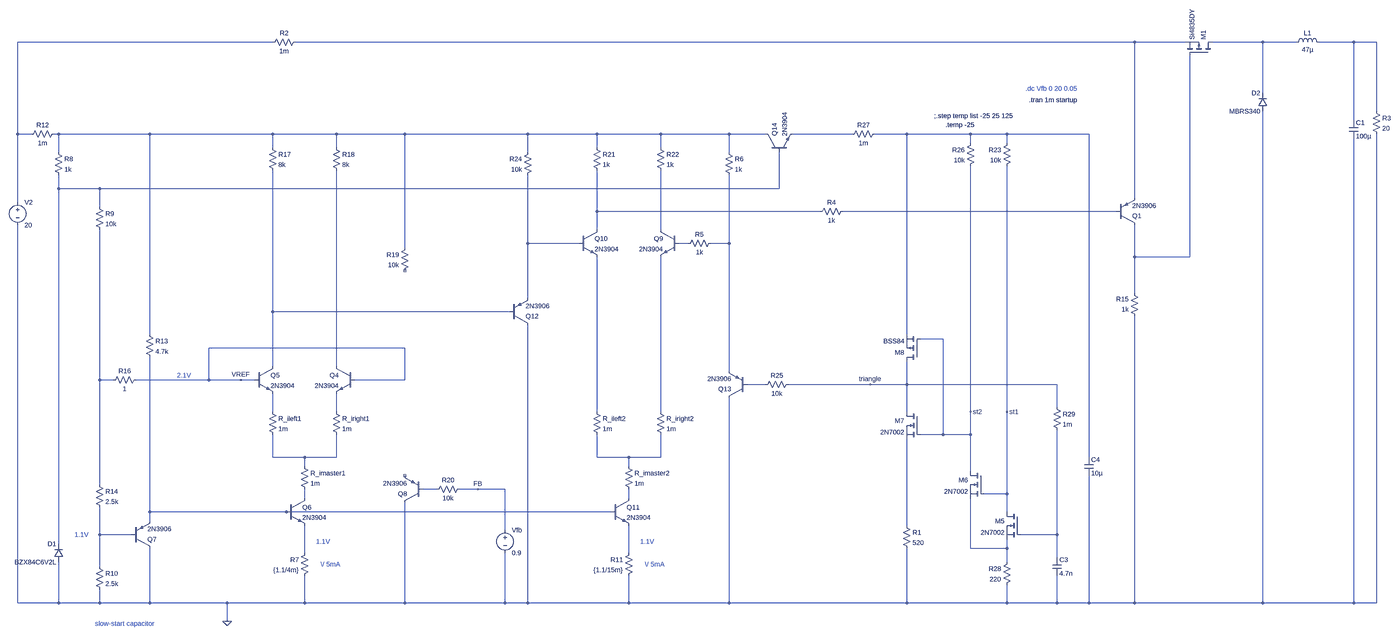
[diagram p0: schematic step_down_trial2_1.asc, whole sheet]
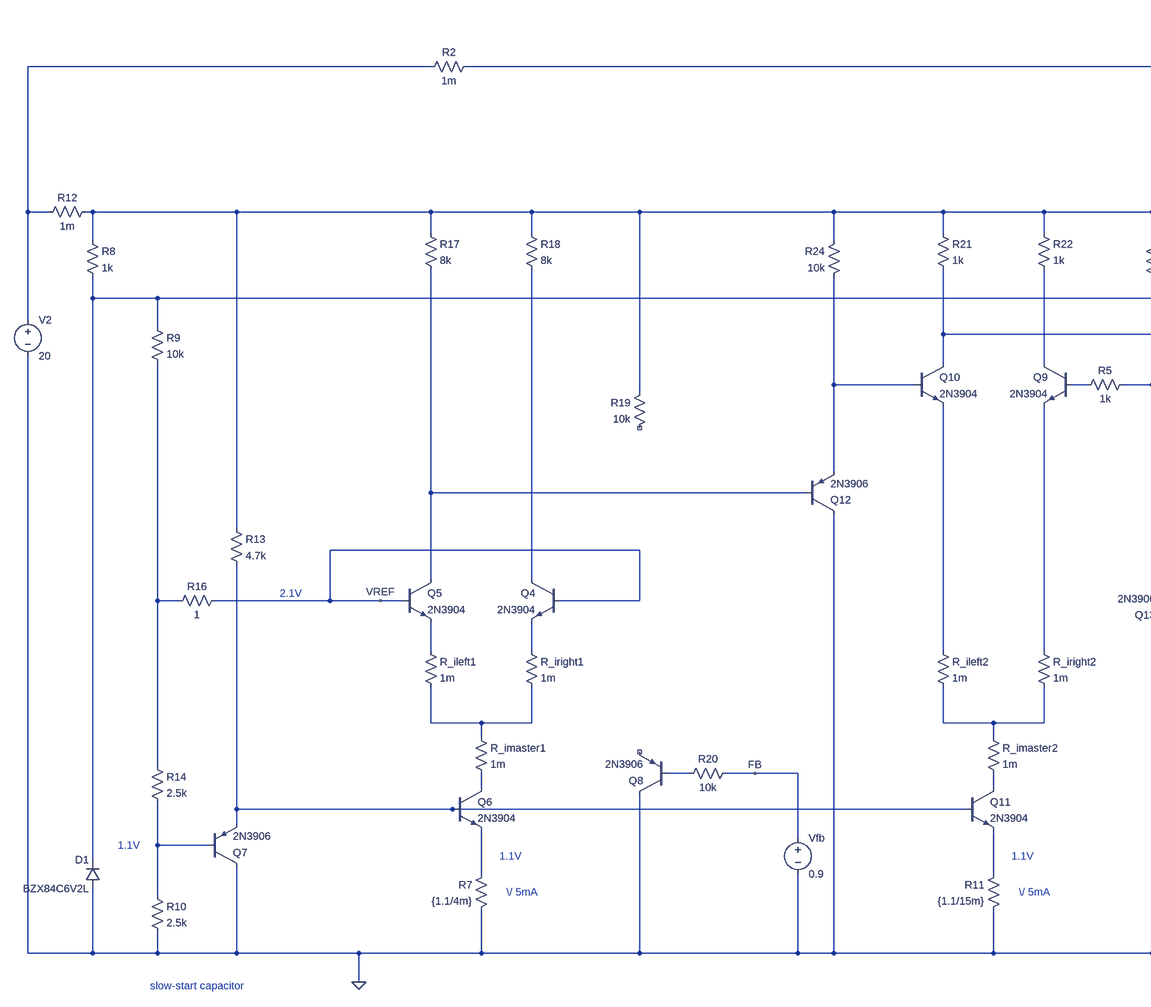
[diagram p1: schematic step_down_trial2_1.asc, part, row 1 of 1, column 1 of 2]
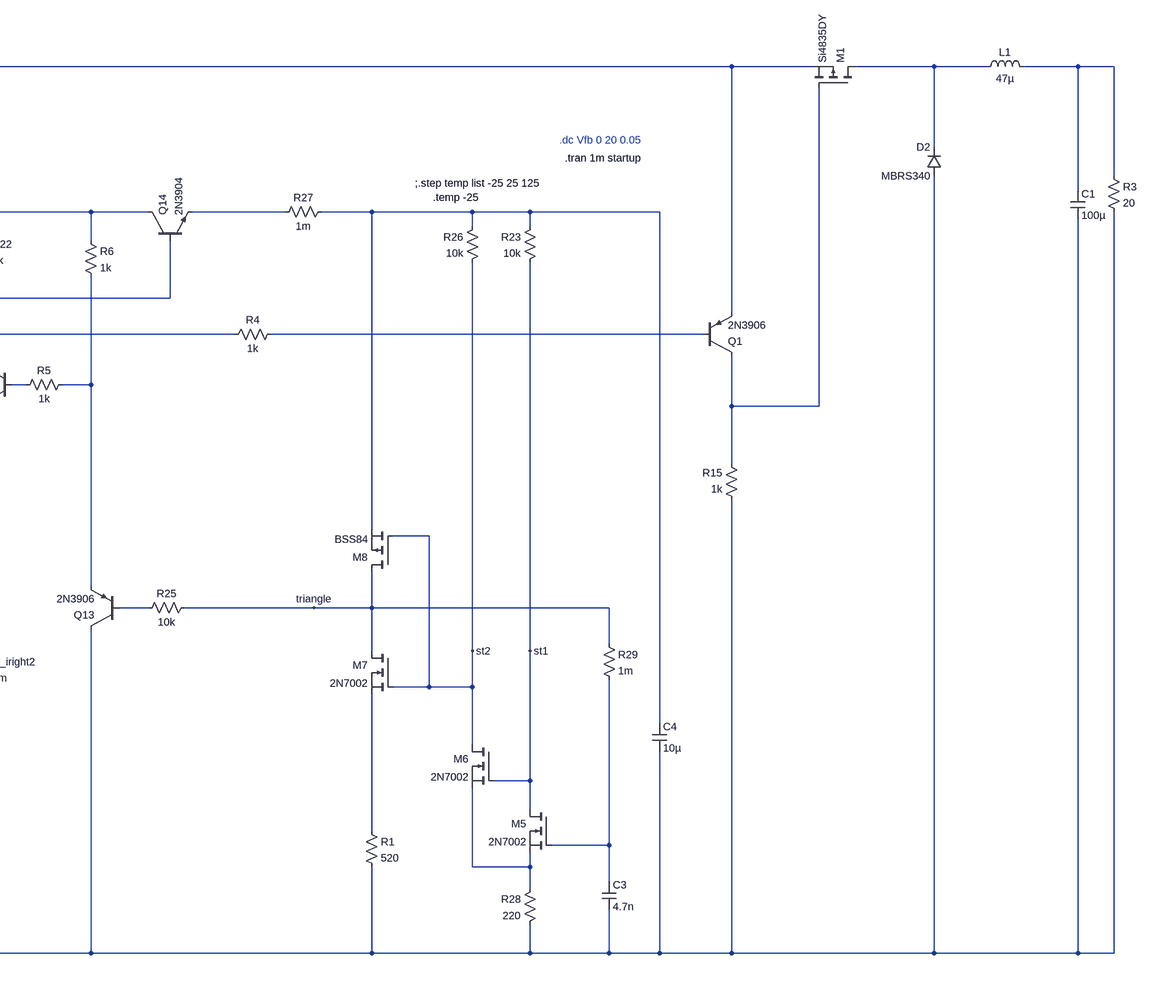
[diagram p2: schematic step_down_trial2_1.asc, part, row 1 of 1, column 2 of 2]
step_down_trial2_1.asc, the LTspice schematic file:
Version 4.1
SHEET 1 6680 712
WIRE 2512 -1392 1616 -1392
WIRE 5584 -1392 2592 -1392
WIRE 5824 -1392 5584 -1392
WIRE 6096 -1392 5920 -1392
WIRE 6224 -1392 6096 -1392
WIRE 6544 -1392 6304 -1392
WIRE 6624 -1392 6544 -1392
WIRE 6096 -1168 6096 -1392
WIRE 6624 -1104 6624 -1392
WIRE 6544 -1072 6544 -1392
WIRE 1616 -1024 1616 -1392
WIRE 1664 -1024 1616 -1024
WIRE 1760 -1024 1744 -1024
WIRE 2080 -1024 1760 -1024
WIRE 2512 -1024 2080 -1024
WIRE 2736 -1024 2512 -1024
WIRE 2976 -1024 2736 -1024
WIRE 3408 -1024 2976 -1024
WIRE 3696 -1024 3408 -1024
WIRE 3920 -1024 3696 -1024
WIRE 4160 -1024 3920 -1024
WIRE 4288 -1024 4160 -1024
WIRE 4592 -1024 4384 -1024
WIRE 4784 -1024 4672 -1024
WIRE 5008 -1024 4784 -1024
WIRE 5136 -1024 5008 -1024
WIRE 5424 -1024 5136 -1024
WIRE 5008 -992 5008 -1024
WIRE 5136 -992 5136 -1024
WIRE 2512 -976 2512 -1024
WIRE 2736 -976 2736 -1024
WIRE 3696 -976 3696 -1024
WIRE 3920 -976 3920 -1024
WIRE 1760 -960 1760 -1024
WIRE 3408 -960 3408 -1024
WIRE 4160 -960 4160 -1024
WIRE 1760 -832 1760 -880
WIRE 1904 -832 1760 -832
WIRE 4336 -832 4336 -960
WIRE 4336 -832 1904 -832
WIRE 5584 -800 5584 -1392
WIRE 1616 -784 1616 -1024
WIRE 1904 -768 1904 -832
WIRE 3696 -752 3696 -896
WIRE 4480 -752 3696 -752
WIRE 5520 -752 4560 -752
WIRE 3696 -688 3696 -752
WIRE 3920 -688 3920 -896
WIRE 3408 -640 3408 -880
WIRE 3632 -640 3408 -640
WIRE 4016 -640 3984 -640
WIRE 4160 -640 4160 -880
WIRE 4160 -640 4096 -640
WIRE 2976 -624 2976 -1024
WIRE 5584 -592 5584 -704
WIRE 5840 -592 5840 -1344
WIRE 5840 -592 5584 -592
WIRE 5584 -464 5584 -592
WIRE 3408 -448 3408 -640
WIRE 2512 -400 2512 -896
WIRE 3344 -400 2512 -400
WIRE 2080 -320 2080 -1024
WIRE 4784 -320 4784 -1024
WIRE 4912 -304 4832 -304
WIRE 2976 -272 2288 -272
WIRE 2512 -208 2512 -400
WIRE 2736 -208 2736 -896
WIRE 4160 -192 4160 -640
WIRE 1904 -160 1904 -688
WIRE 1952 -160 1904 -160
WIRE 2288 -160 2288 -272
WIRE 2288 -160 2032 -160
WIRE 2400 -160 2288 -160
WIRE 2448 -160 2400 -160
WIRE 2976 -160 2976 -272
WIRE 2976 -160 2800 -160
WIRE 4288 -144 4224 -144
WIRE 4656 -144 4368 -144
WIRE 4784 -144 4784 -224
WIRE 4784 -144 4656 -144
WIRE 5312 -144 4784 -144
WIRE 5312 -64 5312 -144
WIRE 2512 -48 2512 -112
WIRE 2736 -48 2736 -112
WIRE 3696 -48 3696 -592
WIRE 3920 -48 3920 -592
WIRE 4784 -48 4784 -144
WIRE 5008 -48 5008 -912
WIRE 5136 -48 5136 -912
WIRE 4912 32 4912 -304
WIRE 4912 32 4832 32
WIRE 5008 32 5008 -48
WIRE 5008 32 4912 32
WIRE 2512 112 2512 32
WIRE 2624 112 2512 112
WIRE 2736 112 2736 32
WIRE 2736 112 2624 112
WIRE 3696 112 3696 32
WIRE 3808 112 3696 112
WIRE 3920 112 3920 32
WIRE 3920 112 3808 112
WIRE 5424 112 5424 -1024
WIRE 2624 144 2624 112
WIRE 3808 144 3808 112
WIRE 5008 160 5008 32
WIRE 1904 208 1904 -160
WIRE 3088 224 3040 224
WIRE 3232 224 3168 224
WIRE 3328 224 3232 224
WIRE 5136 240 5136 -48
WIRE 5136 240 5056 240
WIRE 2624 256 2624 224
WIRE 3808 256 3808 224
WIRE 2080 304 2080 -240
WIRE 2560 304 2080 304
WIRE 3744 304 2560 304
WIRE 5136 304 5136 240
WIRE 2080 336 2080 304
WIRE 4784 352 4784 48
WIRE 3328 368 3328 224
WIRE 1904 384 1904 288
WIRE 2016 384 1904 384
WIRE 5312 384 5312 16
WIRE 5312 384 5184 384
WIRE 1760 416 1760 -832
WIRE 5008 432 5008 256
WIRE 5136 432 5136 400
WIRE 5136 432 5008 432
WIRE 2624 448 2624 352
WIRE 3808 448 3808 352
WIRE 5312 464 5312 384
WIRE 5136 480 5136 432
WIRE 1904 496 1904 384
WIRE 1616 624 1616 -704
WIRE 1760 624 1760 480
WIRE 1760 624 1616 624
WIRE 1904 624 1904 576
WIRE 1904 624 1760 624
WIRE 2080 624 2080 432
WIRE 2080 624 1904 624
WIRE 2352 624 2080 624
WIRE 2624 624 2624 528
WIRE 2624 624 2352 624
WIRE 2976 624 2976 272
WIRE 2976 624 2624 624
WIRE 3328 624 3328 448
WIRE 3328 624 2976 624
WIRE 3408 624 3408 -352
WIRE 3408 624 3328 624
WIRE 3808 624 3808 528
WIRE 3808 624 3408 624
WIRE 4160 624 4160 -96
WIRE 4160 624 3808 624
WIRE 4784 624 4784 432
WIRE 4784 624 4160 624
WIRE 5136 624 5136 560
WIRE 5136 624 4784 624
WIRE 5312 624 5312 528
WIRE 5312 624 5136 624
WIRE 5424 624 5424 176
WIRE 5424 624 5312 624
WIRE 5584 624 5584 -384
WIRE 5584 624 5424 624
WIRE 6096 624 6096 -1104
WIRE 6096 624 5584 624
WIRE 6544 624 6544 -1008
WIRE 6544 624 6096 624
WIRE 6624 624 6624 -1024
WIRE 6624 624 6544 624
WIRE 2352 688 2352 624
FLAG 4656 -144 triangle
FLAG 2352 688 0
FLAG 2400 -160 VREF
FLAG 3232 224 FB
FLAG 5136 -48 st1
FLAG 5008 -48 st2
SYMBOL voltage 1616 -800 R0
SYMATTR InstName V2
SYMATTR Value 20
SYMBOL res 2640 432 M0
SYMATTR InstName R7
SYMATTR Value {1.1/4m}
SYMBOL npn 2800 -208 M0
SYMATTR InstName Q4
SYMATTR Value 2N3904
SYMBOL npn 2448 -208 R0
SYMATTR InstName Q5
SYMATTR Value 2N3904
SYMBOL diode 1776 480 R180
WINDOW 0 24 64 Left 2
WINDOW 3 24 0 Left 2
SYMATTR InstName D1
SYMATTR Value BZX84C6V2L
SYMBOL res 1744 -976 R0
SYMATTR InstName R8
SYMATTR Value 1k
SYMBOL res 1888 -784 R0
SYMATTR InstName R9
SYMATTR Value 10k
SYMBOL res 1888 480 R0
SYMATTR InstName R10
SYMATTR Value 2.5k
SYMBOL res 1648 -1008 R270
WINDOW 0 32 56 VTop 2
WINDOW 3 0 56 VBottom 2
SYMATTR InstName R12
SYMATTR Value 1m
SYMBOL res 2608 128 R0
SYMATTR InstName R_imaster1
SYMATTR Value 1m
SYMBOL npn 2560 256 R0
SYMATTR InstName Q6
SYMATTR Value 2N3904
SYMBOL res 2064 -336 R0
SYMATTR InstName R13
SYMATTR Value 4.7k
SYMBOL pnp 2016 432 M180
SYMATTR InstName Q7
SYMATTR Value 2N3906
SYMBOL res 1888 192 R0
SYMATTR InstName R14
SYMATTR Value 2.5k
SYMBOL res 2496 -64 R0
SYMATTR InstName R_ileft1
SYMATTR Value 1m
SYMBOL res 2720 -64 R0
SYMATTR InstName R_iright1
SYMATTR Value 1m
SYMBOL res 2048 -176 R90
WINDOW 0 0 56 VBottom 2
WINDOW 3 32 56 VTop 2
SYMATTR InstName R16
SYMATTR Value 1
SYMBOL res 2496 -992 R0
SYMATTR InstName R17
SYMATTR Value 8k
SYMBOL res 2720 -992 R0
SYMATTR InstName R18
SYMATTR Value 8k
SYMBOL voltage 3328 352 R0
SYMATTR InstName Vfb
SYMATTR Value 0.9
SYMBOL res 2992 -640 M0
SYMATTR InstName R19
SYMATTR Value 10k
SYMBOL pnp 3040 272 R180
SYMATTR InstName Q8
SYMATTR Value 2N3906
SYMBOL res 3184 208 R90
WINDOW 0 0 56 VBottom 2
WINDOW 3 32 56 VTop 2
SYMATTR InstName R20
SYMATTR Value 10k
SYMBOL res 3824 432 M0
SYMATTR InstName R11
SYMATTR Value {1.1/15m}
SYMBOL npn 3984 -688 M0
SYMATTR InstName Q9
SYMATTR Value 2N3904
SYMBOL npn 3632 -688 R0
SYMATTR InstName Q10
SYMATTR Value 2N3904
SYMBOL res 3792 128 R0
SYMATTR InstName R_imaster2
SYMATTR Value 1m
SYMBOL npn 3744 256 R0
SYMATTR InstName Q11
SYMATTR Value 2N3904
SYMBOL res 3680 -64 R0
SYMATTR InstName R_ileft2
SYMATTR Value 1m
SYMBOL res 3904 -64 R0
SYMATTR InstName R_iright2
SYMATTR Value 1m
SYMBOL res 3680 -992 R0
SYMATTR InstName R21
SYMATTR Value 1k
SYMBOL res 3904 -992 R0
SYMATTR InstName R22
SYMATTR Value 1k
SYMBOL res 3424 -976 M0
SYMATTR InstName R24
SYMATTR Value 10k
SYMBOL pnp 4224 -96 R180
SYMATTR InstName Q13
SYMATTR Value 2N3906
SYMBOL res 4384 -160 R90
WINDOW 0 0 56 VBottom 2
WINDOW 3 32 56 VTop 2
SYMATTR InstName R25
SYMATTR Value 10k
SYMBOL pnp 3344 -352 M180
SYMATTR InstName Q12
SYMATTR Value 2N3906
SYMBOL npn 4288 -960 R270
SYMATTR InstName Q14
SYMATTR Value 2N3904
SYMBOL cap 5408 112 R0
SYMATTR InstName C4
SYMATTR Value 10µ
SYMBOL res 4688 -1040 R90
WINDOW 0 0 56 VBottom 2
WINDOW 3 32 56 VTop 2
SYMATTR InstName R27
SYMATTR Value 1m
SYMBOL res 4112 -656 R90
WINDOW 0 0 56 VBottom 2
WINDOW 3 32 56 VTop 2
SYMATTR InstName R5
SYMATTR Value 1k
SYMBOL res 4144 -976 R0
SYMATTR InstName R6
SYMATTR Value 1k
SYMBOL nmos 5184 304 M0
SYMATTR InstName M5
SYMATTR Value 2N7002
SYMBOL nmos 5056 160 M0
SYMATTR InstName M6
SYMATTR Value 2N7002
SYMBOL res 5152 -1008 M0
SYMATTR InstName R23
SYMATTR Value 10k
SYMBOL res 5024 -1008 M0
SYMATTR InstName R26
SYMATTR Value 10k
SYMBOL res 5152 464 M0
SYMATTR InstName R28
SYMATTR Value 220
SYMBOL nmos 4832 -48 M0
SYMATTR InstName M7
SYMATTR Value 2N7002
SYMBOL pmos 4832 -224 R180
SYMATTR InstName M8
SYMATTR Value BSS84
SYMBOL cap 5296 464 R0
SYMATTR InstName C3
SYMATTR Value 4.7n
SYMBOL res 5296 -80 R0
SYMATTR InstName R29
SYMATTR Value 1m
SYMBOL res 4768 336 R0
SYMATTR InstName R1
SYMATTR Value 520
SYMBOL pmos 5920 -1344 M270
SYMATTR InstName M1
SYMATTR Value Si4835DY
SYMBOL res 2496 -1376 R270
WINDOW 0 32 56 VTop 2
WINDOW 3 0 56 VBottom 2
SYMATTR InstName R2
SYMATTR Value 1m
SYMBOL diode 6112 -1104 R180
WINDOW 0 24 64 Left 2
WINDOW 3 24 0 Left 2
SYMATTR InstName D2
SYMATTR Value MBRS340
SYMATTR Description Diode
SYMATTR Type diode
SYMBOL ind 6208 -1376 R270
WINDOW 0 32 56 VTop 2
WINDOW 3 5 56 VBottom 2
SYMATTR InstName L1
SYMATTR Value 47µ
SYMBOL cap 6528 -1072 R0
SYMATTR InstName C1
SYMATTR Value 100µ
SYMBOL res 6608 -1120 R0
SYMATTR InstName R3
SYMATTR Value 20
SYMBOL res 4576 -768 R90
WINDOW 0 0 56 VBottom 2
WINDOW 3 32 56 VTop 2
SYMATTR InstName R4
SYMATTR Value 1k
SYMBOL res 5600 -368 R180
WINDOW 0 36 76 Left 2
WINDOW 3 36 40 Left 2
SYMATTR InstName R15
SYMATTR Value 1k
SYMBOL pnp 5520 -704 M180
SYMATTR InstName Q1
SYMATTR Value 2N3906
TEXT 5384 -1144 Right 2 !.tran 1m startup
TEXT 1816 384 Left 2 ;1.1V
TEXT 2664 408 Left 2 ;1.1V
TEXT 2680 488 Left 2 ;\\/ 5mA
TEXT 2176 -176 Left 2 ;2.1V
TEXT 1888 696 Left 2 ;slow-start capacitor
TEXT 5384 -1184 Right 2 ;.dc Vfb 0 20 0.05
TEXT 3848 408 Left 2 ;1.1V
TEXT 3864 488 Left 2 ;\\/ 5mA
TEXT 4880 -1088 Left 2 !;.step temp list -25 25 125
TEXT 4920 -1056 Left 2 !.temp -25

The netlist it stands for:
* step_down_trial2_1.asc
V2 N001 0 20
R7 N034 0 {1.1/4m}
Q4 N017 VREF N021 0 2N3904
Q5 N016 VREF N020 0 2N3904
D1 0 N008 BZX84C6V2L
R8 N005 N008 1k
R9 N008 N018 10k
R10 N031 0 2.5k
R12 N001 N005 1m
R_imaster1 N024 N027 1m
Q6 N027 N029 N034 0 2N3904
R13 N005 N029 4.7k
Q7 0 N031 N029 0 2N3906
R14 N018 N031 2.5k
R_ileft1 N020 N024 1m
R_iright1 N021 N024 1m
R16 VREF N018 1
R17 N005 N016 8k
R18 N005 N017 8k
Vfb FB 0 0.9
R19 N005 NC_01 10k
Q8 0 N026 NC_02 0 2N3906
R20 FB N026 10k
R11 N035 0 {1.1/15m}
Q9 N011 N013 N023 0 2N3904
Q10 N009 N012 N022 0 2N3904
R_imaster2 N025 N028 1m
Q11 N028 N029 N035 0 2N3904
R_ileft2 N022 N025 1m
R_iright2 N023 N025 1m
R21 N005 N009 1k
R22 N005 N011 1k
R24 N005 N012 10k
Q13 0 N019 N014 0 2N3906
R25 triangle N019 10k
Q12 0 N016 N012 0 2N3906
Q14 N005 N008 N006 0 2N3904
C4 N007 0 10µ
R27 N007 N006 1m
R5 N014 N013 1k
R6 N005 N014 1k
M5 st1 N032 N033 N033 2N7002
M6 st2 st1 N033 N033 2N7002
R23 N007 st1 10k
R26 N007 st2 10k
R28 N033 0 220
M7 triangle st2 N030 N030 2N7002
M8 triangle st2 N007 N007 BSS84
C3 N032 0 4.7n
R29 triangle N032 1m
R1 N030 0 520
M1 N003 N015 N002 N002 Si4835DY
R2 N001 N002 1m
D2 0 N003 MBRS340
L1 N003 N004 47µ
C1 N004 0 100µ
R3 N004 0 20
R4 N010 N009 1k
R15 0 N015 1k
Q1 N015 N010 N002 0 2N3906
.model D D
.lib standard.dio
.model NPN NPN
.model PNP PNP
.lib standard.bjt
.model NMOS NMOS
.model PMOS PMOS
.lib standard.mos
.tran 1m startup
* 1.1V
* 1.1V
* \/ 5mA
* 2.1V
* slow-start capacitor
* .dc Vfb 0 20 0.05
* 1.1V
* \/ 5mA
;.step temp list -25 25 125
.temp -25
.backanno
.end